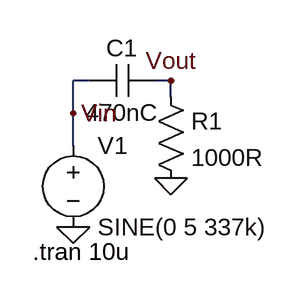
[diagram p0: schematic High pass filter.asc]
High pass filter.asc, the LTspice schematic file:
Version 4
SHEET 1 880 680
WIRE 32 144 16 144
WIRE 112 144 96 144
WIRE 112 160 112 144
WIRE 16 176 16 144
WIRE 16 208 16 176
FLAG 16 288 0
FLAG 112 240 0
FLAG 112 144 Vout
FLAG 16 176 Vin
SYMBOL voltage 16 192 R0
WINDOW 123 0 0 Left 0
WINDOW 39 0 0 Left 0
SYMATTR InstName V1
SYMATTR Value SINE(0 5 337k)
SYMBOL cap 96 128 R90
WINDOW 0 0 32 VBottom 2
WINDOW 3 32 32 VTop 2
SYMATTR InstName C1
SYMATTR Value 470nC
SYMBOL res 96 144 R0
SYMATTR InstName R1
SYMATTR Value 1000R
TEXT -24 312 Left 2 !.tran 10u

The netlist it stands for:
* High pass filter.asc
V1 Vin 0 SINE(0 5 337k)
C1 Vout Vin 470nC
R1 Vout 0 1000R
.tran 10u
.backanno
.end